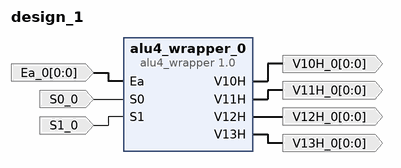
[diagram p0: block diagram of the top level]
# Vivado block design design_1, xc7a35tcsg324-3, Vivado 2018.1
create_bd_design design_1

create_bd_port -dir I -from 0 -to 0 Ea_0
create_bd_port -dir I S0_0
create_bd_port -dir I S1_0
create_bd_port -dir O -from 0 -to 0 V10H_0
create_bd_port -dir O -from 0 -to 0 V11H_0
create_bd_port -dir O -from 0 -to 0 V12H_0
create_bd_port -dir O -from 0 -to 0 V13H_0

create_bd_cell -type ip -vlnv xilinx.com:user:alu4_wrapper:1.0 alu4_wrapper_0

# ---- connections ----

connect_bd_net -net Ea_0_1 [get_bd_ports Ea_0] [get_bd_pins alu4_wrapper_0/Ea]
connect_bd_net -net S0_0_1 [get_bd_ports S0_0] [get_bd_pins alu4_wrapper_0/S0]
connect_bd_net -net S1_0_1 [get_bd_ports S1_0] [get_bd_pins alu4_wrapper_0/S1]
connect_bd_net [get_bd_pins alu4_wrapper_0/V10H] [get_bd_ports V10H_0]
connect_bd_net [get_bd_pins alu4_wrapper_0/V11H] [get_bd_ports V11H_0]
connect_bd_net [get_bd_pins alu4_wrapper_0/V12H] [get_bd_ports V12H_0]
connect_bd_net [get_bd_pins alu4_wrapper_0/V13H] [get_bd_ports V13H_0]

validate_bd_design
save_bd_design
